# Altium schematic sheet sensors.SchDoc
size A4
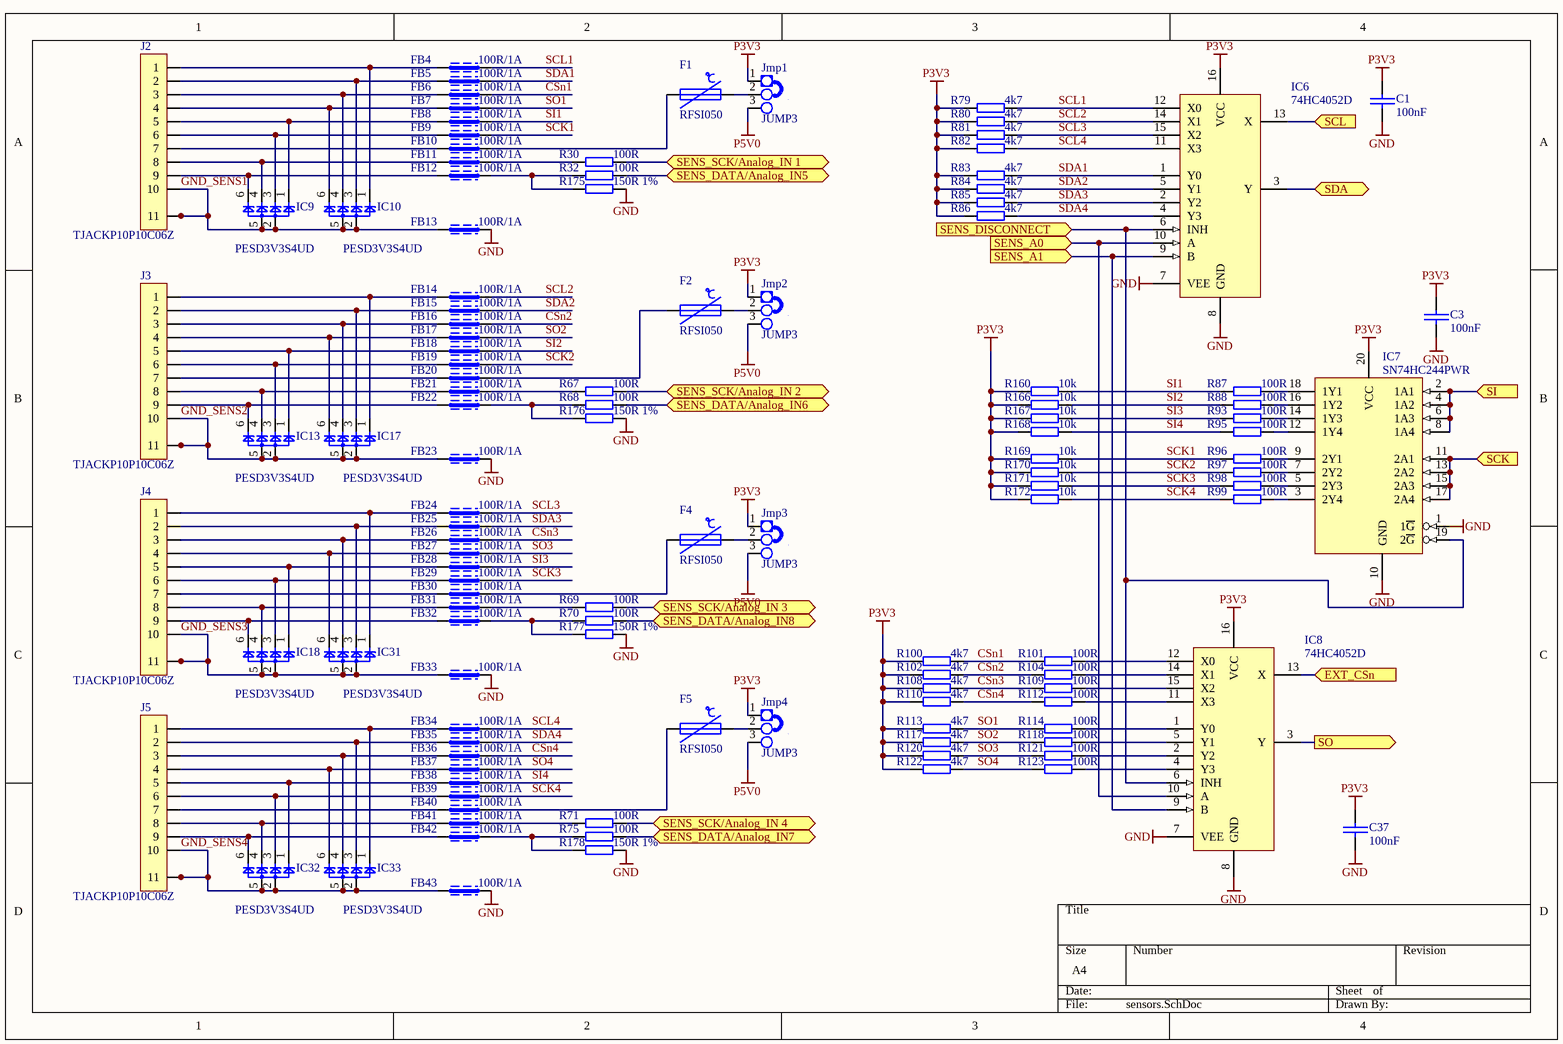
[diagram p0: sensors.SchDoc]

## Parts
C1  100nF  [0402C]
C3  100nF  [0402C]
C37  100nF  [0402C]
F1  RFSI050  [0805R]
F2  RFSI050  [0805R]
F4  RFSI050  [0805R]
F5  RFSI050  [0805R]
FB4  100R/1A  [0603L]
FB5  100R/1A  [0603L]
FB6  100R/1A  [0603L]
FB7  100R/1A  [0603L]
FB8  100R/1A  [0603L]
FB9  100R/1A  [0603L]
FB10  100R/1A  [0603L]
FB11  100R/1A  [0603L]
FB12  100R/1A  [0603L]
FB13  100R/1A  [0603L]
FB14  100R/1A  [0603L]
FB15  100R/1A  [0603L]
FB16  100R/1A  [0603L]
FB17  100R/1A  [0603L]
FB18  100R/1A  [0603L]
FB19  100R/1A  [0603L]
FB20  100R/1A  [0603L]
FB21  100R/1A  [0603L]
FB22  100R/1A  [0603L]
FB23  100R/1A  [0603L]
FB24  100R/1A  [0603L]
FB25  100R/1A  [0603L]
FB26  100R/1A  [0603L]
FB27  100R/1A  [0603L]
FB28  100R/1A  [0603L]
FB29  100R/1A  [0603L]
FB30  100R/1A  [0603L]
FB31  100R/1A  [0603L]
FB32  100R/1A  [0603L]
FB33  100R/1A  [0603L]
FB34  100R/1A  [0603L]
FB35  100R/1A  [0603L]
FB36  100R/1A  [0603L]
FB37  100R/1A  [0603L]
FB38  100R/1A  [0603L]
FB39  100R/1A  [0603L]
FB40  100R/1A  [0603L]
FB41  100R/1A  [0603L]
FB42  100R/1A  [0603L]
FB43  100R/1A  [0603L]
IC6  74HC4052D  [SO-16]
IC7  SN74HC244PWR  [tssop20]
IC8  74HC4052D  [SO-16]
IC9  PESD3V3S4UD  [SOT457]
IC10  PESD3V3S4UD  [SOT457]
IC13  PESD3V3S4UD  [SOT457]
IC17  PESD3V3S4UD  [SOT457]
IC18  PESD3V3S4UD  [SOT457]
IC31  PESD3V3S4UD  [SOT457]
IC32  PESD3V3S4UD  [SOT457]
IC33  PESD3V3S4UD  [SOT457]
J2  TJACKP10P10C06Z  [TJACKP10P10C06Z]
J3  TJACKP10P10C06Z  [TJACKP10P10C06Z]
J4  TJACKP10P10C06Z  [TJACKP10P10C06Z]
J5  TJACKP10P10C06Z  [TJACKP10P10C06Z]
Jmp1  JUMP3  [jump3]
Jmp2  JUMP3  [jump3]
Jmp3  JUMP3  [jump3]
Jmp4  JUMP3  [jump3]
R30  100R  [0402R]
R32  100R  [0402R]
R67  100R  [0402R]
R68  100R  [0402R]
R69  100R  [0402R]
R70  100R  [0402R]
R71  100R  [0402R]
R75  100R  [0402R]
R79  4k7  [0402R]
R80  4k7  [0402R]
R81  4k7  [0402R]
R82  4k7  [0402R]
R83  4k7  [0402R]
R84  4k7  [0402R]
R85  4k7  [0402R]
R86  4k7  [0402R]
R87  100R  [0402R]
R88  100R  [0402R]
R93  100R  [0402R]
R95  100R  [0402R]
R96  100R  [0402R]
R97  100R  [0402R]
R98  100R  [0402R]
R99  100R  [0402R]
R100  4k7  [0402R]
R101  100R  [0402R]
R102  4k7  [0402R]
R104  100R  [0402R]
R108  4k7  [0402R]
R109  100R  [0402R]
R110  4k7  [0402R]
R112  100R  [0402R]
R113  4k7  [0402R]
R114  100R  [0402R]
R117  4k7  [0402R]
R118  100R  [0402R]
R120  4k7  [0402R]
R121  100R  [0402R]
R122  4k7  [0402R]
R123  100R  [0402R]
R160  10k  [0402R]
R166  10k  [0402R]
R167  10k  [0402R]
R168  10k  [0402R]
R169  10k  [0402R]
R170  10k  [0402R]
R171  10k  [0402R]
R172  10k  [0402R]
R175  150R 1%  [0805R]
R176  150R 1%  [0805R]
R177  150R 1%  [0805R]
R178  150R 1%  [0805R]

## Ports
EXT_CSn (in), SCK (in), SCL (in), SDA (bidir), SENS_A0 (in), SENS_A1 (in), SENS_DATA/Analog_IN5 (bidir), SENS_DATA/Analog_IN6 (bidir), SENS_DATA/Analog_IN7 (bidir), SENS_DATA/Analog_IN8 (bidir), SENS_DISCONNECT (in), SENS_SCK/Analog_IN 1 (bidir), SENS_SCK/Analog_IN 2 (bidir), SENS_SCK/Analog_IN 3 (bidir), SENS_SCK/Analog_IN 4 (bidir), SI (in), SO (out)

## Nets
GND: C1.2 C3.2 C37.2 FB13.2 FB23.2 FB33.2 FB43.2 IC6.7(VEE) IC6.8(GND) IC7.1(1~{G}) IC7.10(GND) IC8.7(VEE) IC8.8(GND) R175.2 R176.2 R177.2 R178.2
P3V3: C1.1 C3.1 C37.1 IC6.16(VCC) IC7.20(VCC) IC8.16(VCC) Jmp1.1 Jmp2.1 Jmp3.1 Jmp4.1 R79.1 R80.1 R81.1 R82.1 R83.1 R84.1 R85.1 R86.1 R100.1 R102.1 R108.1 R110.1 R113.1 R117.1 R120.1 R122.1 R160.1 R166.1 R167.1 R168.1 R169.1 R170.1 R171.1 R172.1
P5V0: Jmp1.3 Jmp2.3 Jmp3.3 Jmp4.3
CSn1: FB6.2 R100.2 R101.1
CSn2: FB16.2 R102.2 R104.1
CSn3: FB26.2 R108.2 R109.1
CSn4: FB36.2 R110.2 R112.1
EXT_CSn: IC8.13(X) ; port EXT_CSn
GND_SENS1: FB13.1 IC9.2 IC9.5 IC10.2 IC10.5 J2.10 J2.11 J2.11a J2.12 J2.12a
GND_SENS2: FB23.1 IC13.2 IC13.5 IC17.2 IC17.5 J3.10 J3.11 J3.11a J3.12 J3.12a
GND_SENS3: FB33.1 IC18.2 IC18.5 IC31.2 IC31.5 J4.10 J4.11 J4.11a J4.12 J4.12a
GND_SENS4: FB43.1 IC32.2 IC32.5 IC33.2 IC33.5 J5.10 J5.11 J5.11a J5.12 J5.12a
SCK: IC7.11(2A1) IC7.13(2A2) IC7.15(2A3) IC7.17(2A4) ; port SCK
SCK1: FB9.2 R96.1 R169.2
SCK2: FB19.2 R97.1 R170.2
SCK3: FB29.2 R98.1 R171.2
SCK4: FB39.2 R99.1 R172.2
SCL: IC6.13(X) ; port SCL
SCL1: FB4.2 IC6.12(X0) R79.2
SCL2: FB14.2 IC6.14(X1) R80.2
SCL3: FB24.2 IC6.15(X2) R81.2
SCL4: FB34.2 IC6.11(X3) R82.2
SDA: IC6.3(Y) ; port SDA
SDA1: FB5.2 IC6.1(Y0) R83.2
SDA2: FB15.2 IC6.5(Y1) R84.2
SDA3: FB25.2 IC6.2(Y2) R85.2
SDA4: FB35.2 IC6.4(Y3) R86.2
SENS_A0: IC6.10(A) IC8.10(A) ; port SENS_A0
SENS_A1: IC6.9(B) IC8.9(B) ; port SENS_A1
SENS_DATA/Analog_IN5: R32.2 ; port SENS_DATA/Analog_IN5
SENS_DATA/Analog_IN6: R68.2 ; port SENS_DATA/Analog_IN6
SENS_DATA/Analog_IN7: R75.2 ; port SENS_DATA/Analog_IN7
SENS_DATA/Analog_IN8: R70.2 ; port SENS_DATA/Analog_IN8
SENS_DISCONNECT: IC6.6(INH) IC7.19(2~{G}) IC8.6(INH) ; port SENS_DISCONNECT
SENS_SCK/Analog_IN 1: R30.2 ; port SENS_SCK/Analog_IN 1
SENS_SCK/Analog_IN 2: R67.2 ; port SENS_SCK/Analog_IN 2
SENS_SCK/Analog_IN 3: R69.2 ; port SENS_SCK/Analog_IN 3
SENS_SCK/Analog_IN 4: R71.2 ; port SENS_SCK/Analog_IN 4
SI: IC7.2(1A1) IC7.4(1A2) IC7.6(1A3) IC7.8(1A4) ; port SI
SI1: FB8.2 R87.1 R160.2
SI2: FB18.2 R88.1 R166.2
SI3: FB28.2 R93.1 R167.2
SI4: FB38.2 R95.1 R168.2
SO: IC8.3(Y) ; port SO
SO1: FB7.2 R113.2 R114.1
SO2: FB17.2 R117.2 R118.1
SO3: FB27.2 R120.2 R121.1
SO4: FB37.2 R122.2 R123.1
NetF1_1: F1.1 FB10.2
NetF1_2: F1.2 Jmp1.2
NetF2_1: F2.1 FB20.2
NetF2_2: F2.2 Jmp2.2
NetF4_1: F4.1 FB30.2
NetF4_2: F4.2 Jmp3.2
NetF5_1: F5.1 FB40.2
NetF5_2: F5.2 Jmp4.2
NetFB4_1: FB4.1 IC10.1 J2.1
NetFB5_1: FB5.1 IC10.3 J2.2
NetFB6_1: FB6.1 IC10.4 J2.3
NetFB7_1: FB7.1 IC10.6 J2.4
NetFB8_1: FB8.1 IC9.1 J2.5
NetFB9_1: FB9.1 IC9.3 J2.6
NetFB10_1: FB10.1 J2.7
NetFB11_1: FB11.1 IC9.4 J2.8
NetFB11_2: FB11.2 R30.1
NetFB12_1: FB12.1 IC9.6 J2.9
NetFB12_2: FB12.2 R32.1 R175.1
NetFB14_1: FB14.1 IC17.1 J3.1
NetFB15_1: FB15.1 IC17.3 J3.2
NetFB16_1: FB16.1 IC17.4 J3.3
NetFB17_1: FB17.1 IC17.6 J3.4
NetFB18_1: FB18.1 IC13.1 J3.5
NetFB19_1: FB19.1 IC13.3 J3.6
NetFB20_1: FB20.1 J3.7
NetFB21_1: FB21.1 IC13.4 J3.8
NetFB21_2: FB21.2 R67.1
NetFB22_1: FB22.1 IC13.6 J3.9
NetFB22_2: FB22.2 R68.1 R176.1
NetFB24_1: FB24.1 IC31.1 J4.1
NetFB25_1: FB25.1 IC31.3 J4.2
NetFB26_1: FB26.1 IC31.4 J4.3
NetFB27_1: FB27.1 IC31.6 J4.4
NetFB28_1: FB28.1 IC18.1 J4.5
NetFB29_1: FB29.1 IC18.3 J4.6
NetFB30_1: FB30.1 J4.7
NetFB31_1: FB31.1 IC18.4 J4.8
NetFB31_2: FB31.2 R69.1
NetFB32_1: FB32.1 IC18.6 J4.9
NetFB32_2: FB32.2 R70.1 R177.1
NetFB34_1: FB34.1 IC33.1 J5.1
NetFB35_1: FB35.1 IC33.3 J5.2
NetFB36_1: FB36.1 IC33.4 J5.3
NetFB37_1: FB37.1 IC33.6 J5.4
NetFB38_1: FB38.1 IC32.1 J5.5
NetFB39_1: FB39.1 IC32.3 J5.6
NetFB40_1: FB40.1 J5.7
NetFB41_1: FB41.1 IC32.4 J5.8
NetFB41_2: FB41.2 R71.1
NetFB42_1: FB42.1 IC32.6 J5.9
NetFB42_2: FB42.2 R75.1 R178.1
NetIC7_3: IC7.3(2Y4) R99.2
NetIC7_5: IC7.5(2Y3) R98.2
NetIC7_7: IC7.7(2Y2) R97.2
NetIC7_9: IC7.9(2Y1) R96.2
NetIC7_12: IC7.12(1Y4) R95.2
NetIC7_14: IC7.14(1Y3) R93.2
NetIC7_16: IC7.16(1Y2) R88.2
NetIC7_18: IC7.18(1Y1) R87.2
NetIC8_1: IC8.1(Y0) R114.2
NetIC8_2: IC8.2(Y2) R121.2
NetIC8_4: IC8.4(Y3) R123.2
NetIC8_5: IC8.5(Y1) R118.2
NetIC8_11: IC8.11(X3) R112.2
NetIC8_12: IC8.12(X0) R101.2
NetIC8_14: IC8.14(X1) R104.2
NetIC8_15: IC8.15(X2) R109.2

## Library data of the parts
C1 C3 C37 = CAP_SMD_0402: Capacitor SMD; Supplier 1: Newark; Supplier Part Number 1: 14T3275
F1 F2 F4 F5 = F_PTC_0.05A: 50mA polymer FUSE
FB4-FB43 = L_FERRITE_BEAD_0603: ferrite bead 100R@100MHz 1A; Supplier 1: Newark; Supplier Part Number 1: 89R3144
IC6 IC8 = 4052
IC7 = 74HC244: TTL BUS tristate
IC9 IC10 IC13 IC17 IC18 IC31-IC33 = D_TVS_PESD3V3S4UD: 3.3V TVS
J2-J5 = CON_MOD_10pin_V: Modular 10pin (Maritex or Molex)
R30 R32 R67-R71 R75 R79-R88 R93 R95-R102 R104 R108-R110 R112-R114 R117 R118 R120-R123 R160 R166-R172 = RES_0402: SMD Resistor; Supplier 1: Newark; Supplier Part Number 1: 59M6691
R175-R178 = RES_0805: SMD Resistor; Supplier 1: Newark; Supplier Part Number 1: 05F1507